# EAGLE design saha-aux (EAGLE 9.5.0)

## Sheet 1 of 3
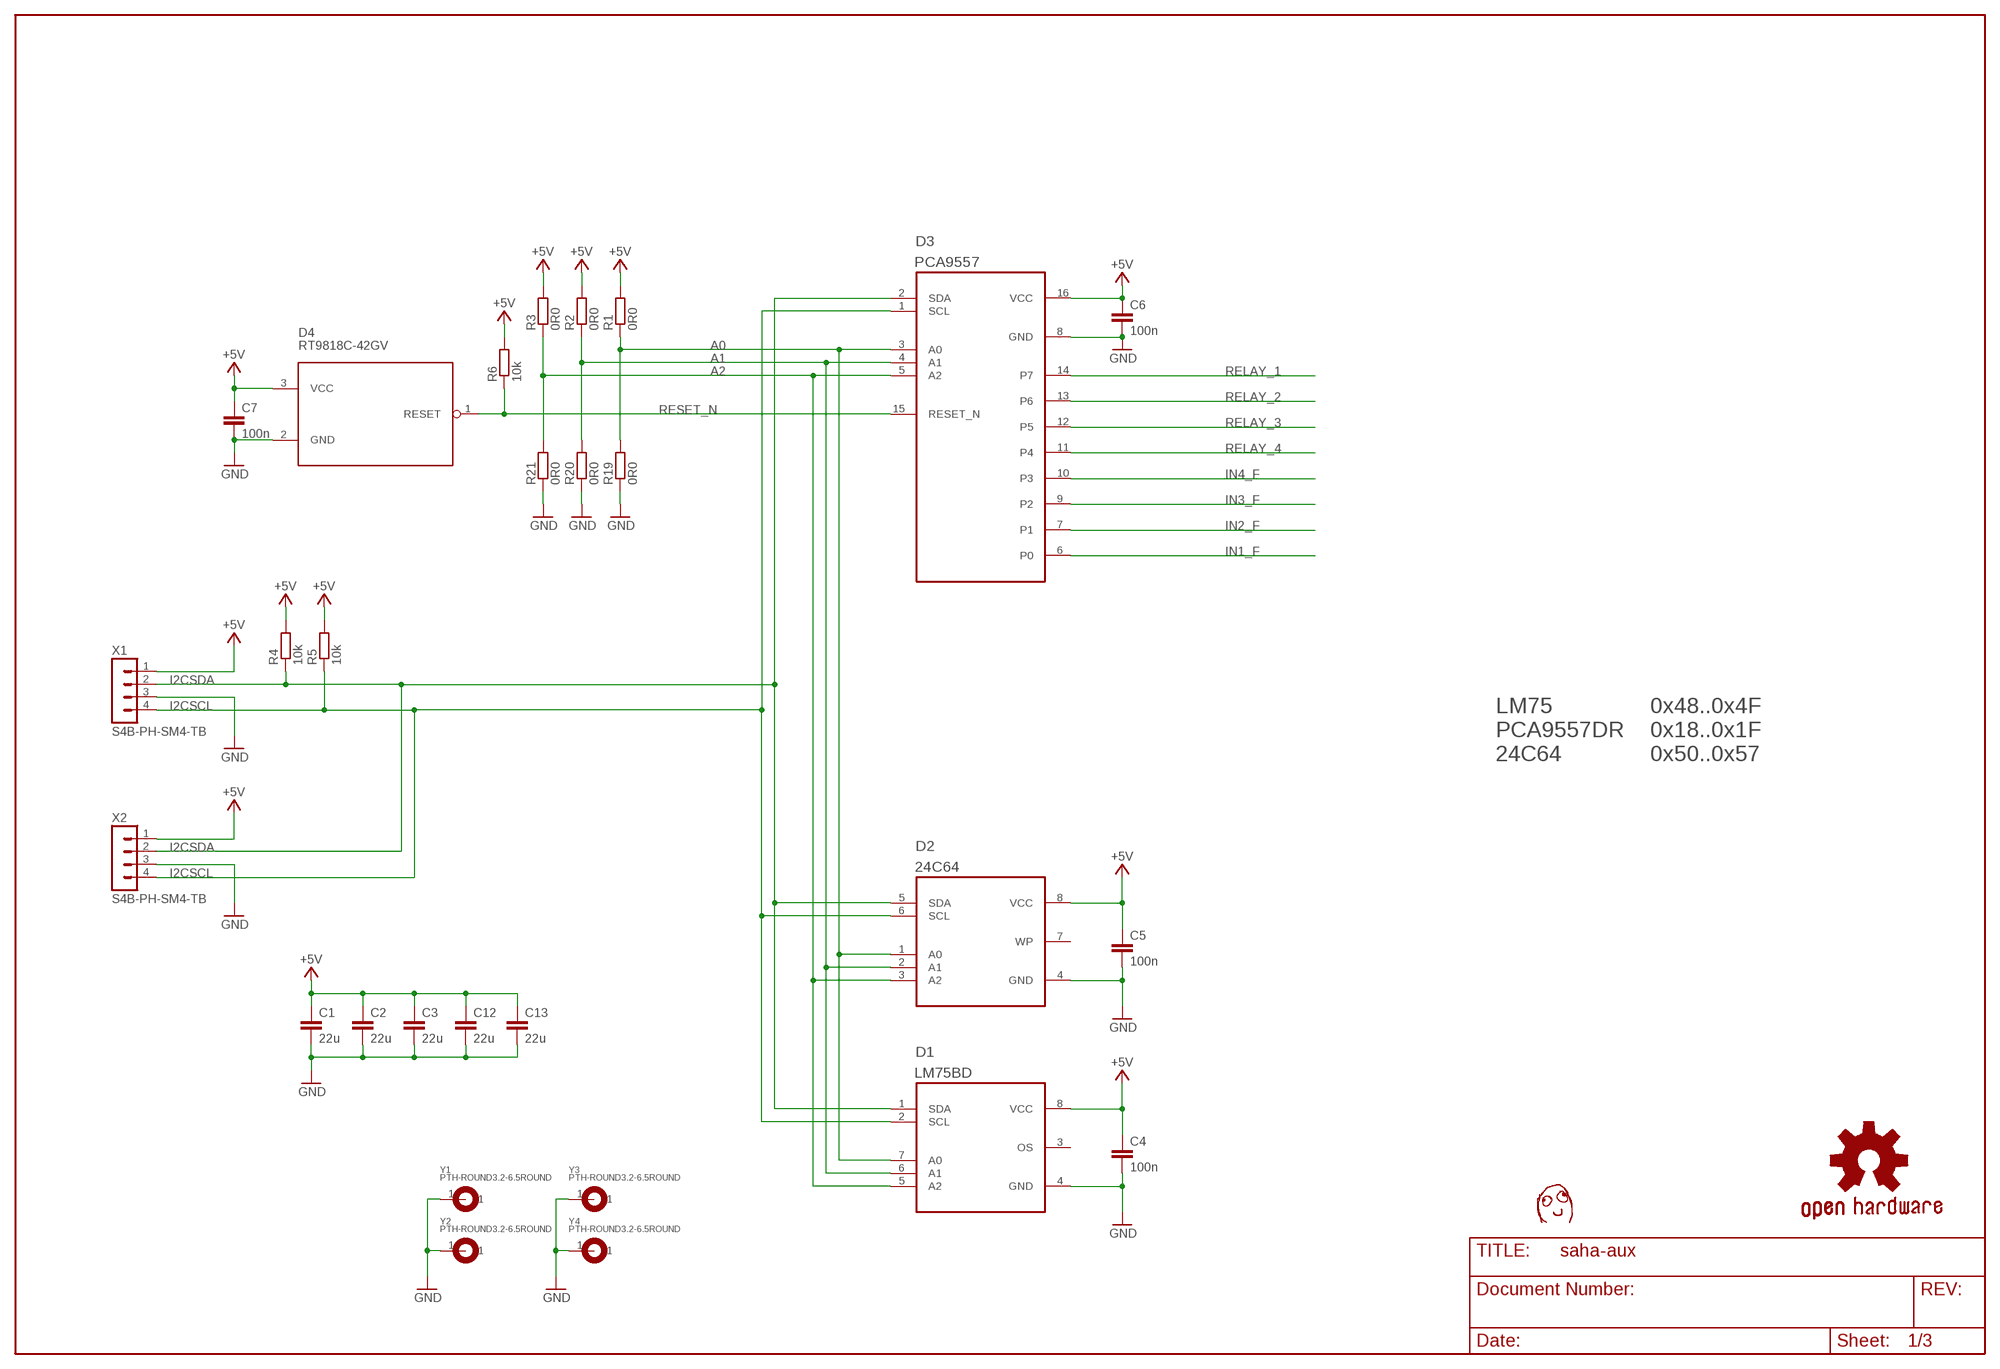
[diagram p0: schematic, sheet 1]

### Parts
C1  22u  CAP0805  [C0805]
C2  22u  CAP0805  [C0805]
C3  22u  CAP0805  [C0805]
C4  100n  CAP0603  [C0603]
C5  100n  CAP0603  [C0603]
C6  100n  CAP0603  [C0603]
C7  100n  CAP0603  [C0603]
C12  22u  CAP0805  [C0805]
C13  22u  CAP0805  [C0805]
D1  LM75BD  [SOIC8-N]
D2  24C64  [SOIC8-N]
D3  PCA9557  [SOIC16-N]
D4  RT9818C-42GV  [SOT23]
R1  0R0  RES0603  [R0603]
R2  0R0  RES0603  [R0603]
R3  0R0  RES0603  [R0603]
R4  10k  RES0603  [R0603]
R5  10k  RES0603  [R0603]
R6  10k  RES0603  [R0603]
R19  0R0  RES0603  [R0603]
R20  0R0  RES0603  [R0603]
R21  0R0  RES0603  [R0603]
U$1  DAFUG  [DAFUG]
X1  S4B-PH-SM4-TB  [JST-PH2.0-RA-4]
X2  S4B-PH-SM4-TB  [JST-PH2.0-RA-4]
Y1  PTH-ROUND3.2-6.5ROUND  [EKE_PTH-3.2-6.5]
Y2  PTH-ROUND3.2-6.5ROUND  [EKE_PTH-3.2-6.5]
Y3  PTH-ROUND3.2-6.5ROUND  [EKE_PTH-3.2-6.5]
Y4  PTH-ROUND3.2-6.5ROUND  [EKE_PTH-3.2-6.5]

### Nets
+5V: C1.1 C2.1 C3.1 C4.1 C5.1 C6.1 C7.1 C12.1 C13.1 D1.8(VCC) D2.8(VCC) D3.16(VCC) D4.3(VCC) R1.2 R2.2 R3.2 R4.2 R5.2 R6.2 X1.1 X2.1 ; also sheet 2,3
A0: D1.7(A0) D2.1(A0) D3.3(A0) R1.1 R19.2
A1: D1.6(A1) D2.2(A1) D3.4(A1) R2.1 R20.2
A2: D1.5(A2) D2.3(A2) D3.5(A2) R3.1 R21.2
GND: C1.2 C2.2 C3.2 C4.2 C5.2 C6.2 C7.2 C12.2 C13.2 D1.4(GND) D2.4(GND) D3.8(GND) D4.2(GND) R19.1 R20.1 R21.1 X1.3 X2.3 Y1.1 Y2.1 Y3.1 Y4.1 ; also sheet 2,3
I2CSCL: D1.2(SCL) D2.6(SCL) D3.1(SCL) R5.1 X1.4 X2.4
I2CSDA: D1.1(SDA) D2.5(SDA) D3.2(SDA) R4.1 X1.2 X2.2
IN1_F: D3.6(P0) ; also sheet 2
IN2_F: D3.7(P1) ; also sheet 2
IN3_F: D3.9(P2) ; also sheet 2
IN4_F: D3.10(P3) ; also sheet 2
RELAY_1: D3.14(P7) ; also sheet 3
RELAY_2: D3.13(P6) ; also sheet 3
RELAY_3: D3.12(P5) ; also sheet 3
RELAY_4: D3.11(P4) ; also sheet 3
RESET_N: D3.15(RESET_N) D4.1(RESET) R6.1
Unconnected: D1.3(OS) D2.7(WP)

### Notes on the sheet
- LM75     
  PCA9557DR
  24C64
- 0x48..0x4F
  0x18..0x1F
  0x50..0x57

## Sheet 2 of 3
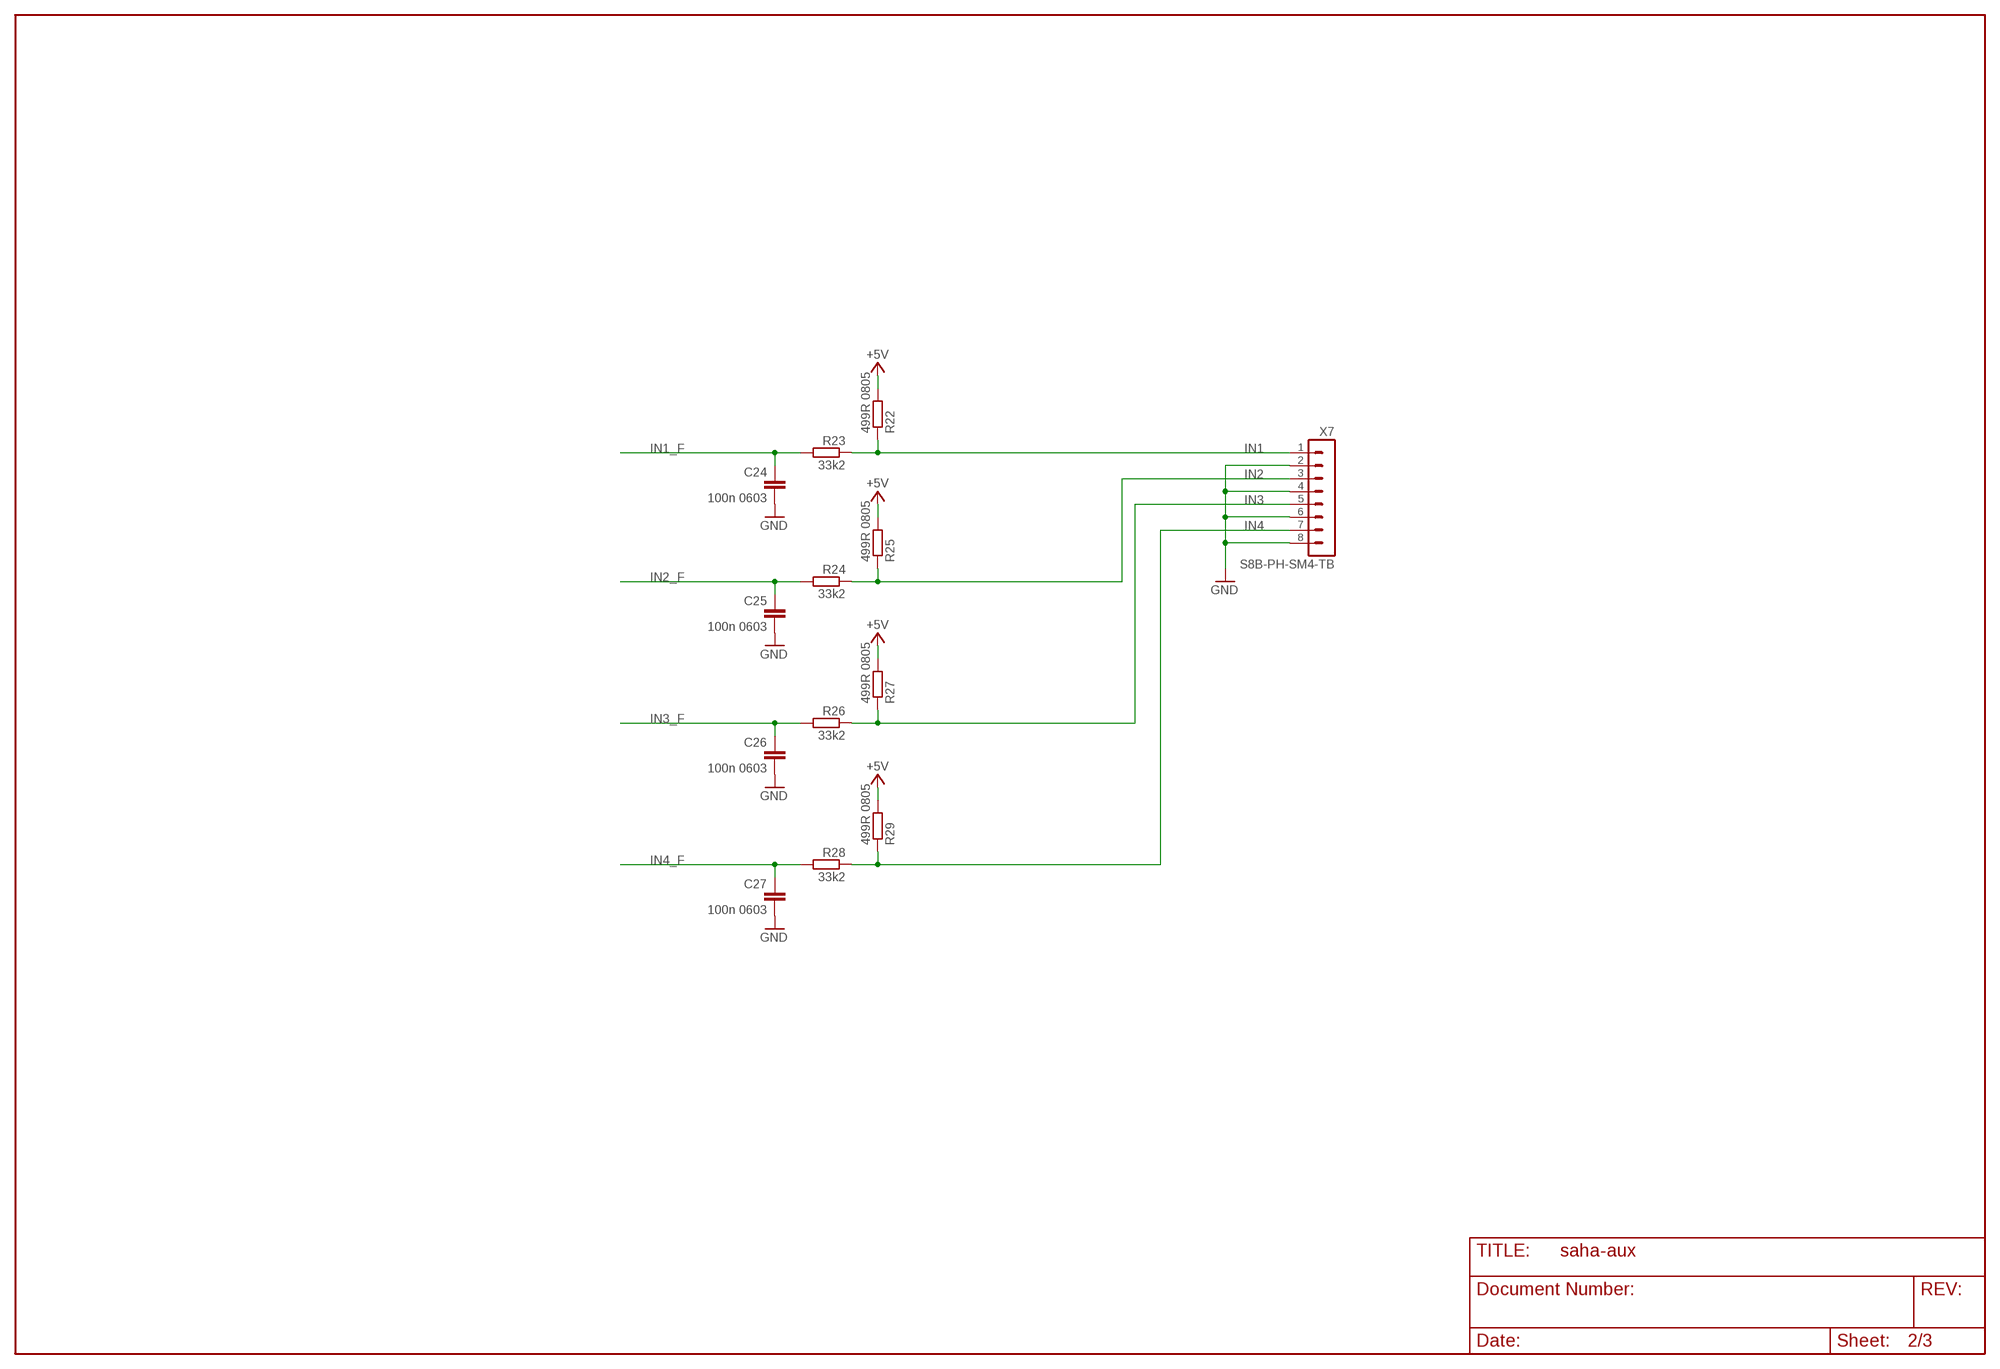
[diagram p1: schematic, sheet 2]

### Parts
C24  100n 0603  CAP0603  [C0603]
C25  100n 0603  CAP0603  [C0603]
C26  100n 0603  CAP0603  [C0603]
C27  100n 0603  CAP0603  [C0603]
R22  499R 0805  RES0805  [R0805]
R23  33k2  RES0603  [R0603]
R24  33k2  RES0603  [R0603]
R25  499R 0805  RES0805  [R0805]
R26  33k2  RES0603  [R0603]
R27  499R 0805  RES0805  [R0805]
R28  33k2  RES0603  [R0603]
R29  499R 0805  RES0805  [R0805]
X7  S8B-PH-SM4-TB  [JST-PH2.0-RA-8]

### Nets
+5V: R22.2 R25.2 R27.2 R29.2 ; also sheet 1,3
GND: C24.2 C25.2 C26.2 C27.2 X7.2 X7.4 X7.6 X7.8 ; also sheet 1,3
IN1: R22.1 R23.1 X7.1
IN1_F: C24.1 R23.2 ; also sheet 1
IN2: R24.1 R25.1 X7.3
IN2_F: C25.1 R24.2 ; also sheet 1
IN3: R26.1 R27.1 X7.5
IN3_F: C26.1 R26.2 ; also sheet 1
IN4: R28.1 R29.1 X7.7
IN4_F: C27.1 R28.2 ; also sheet 1

## Sheet 3 of 3
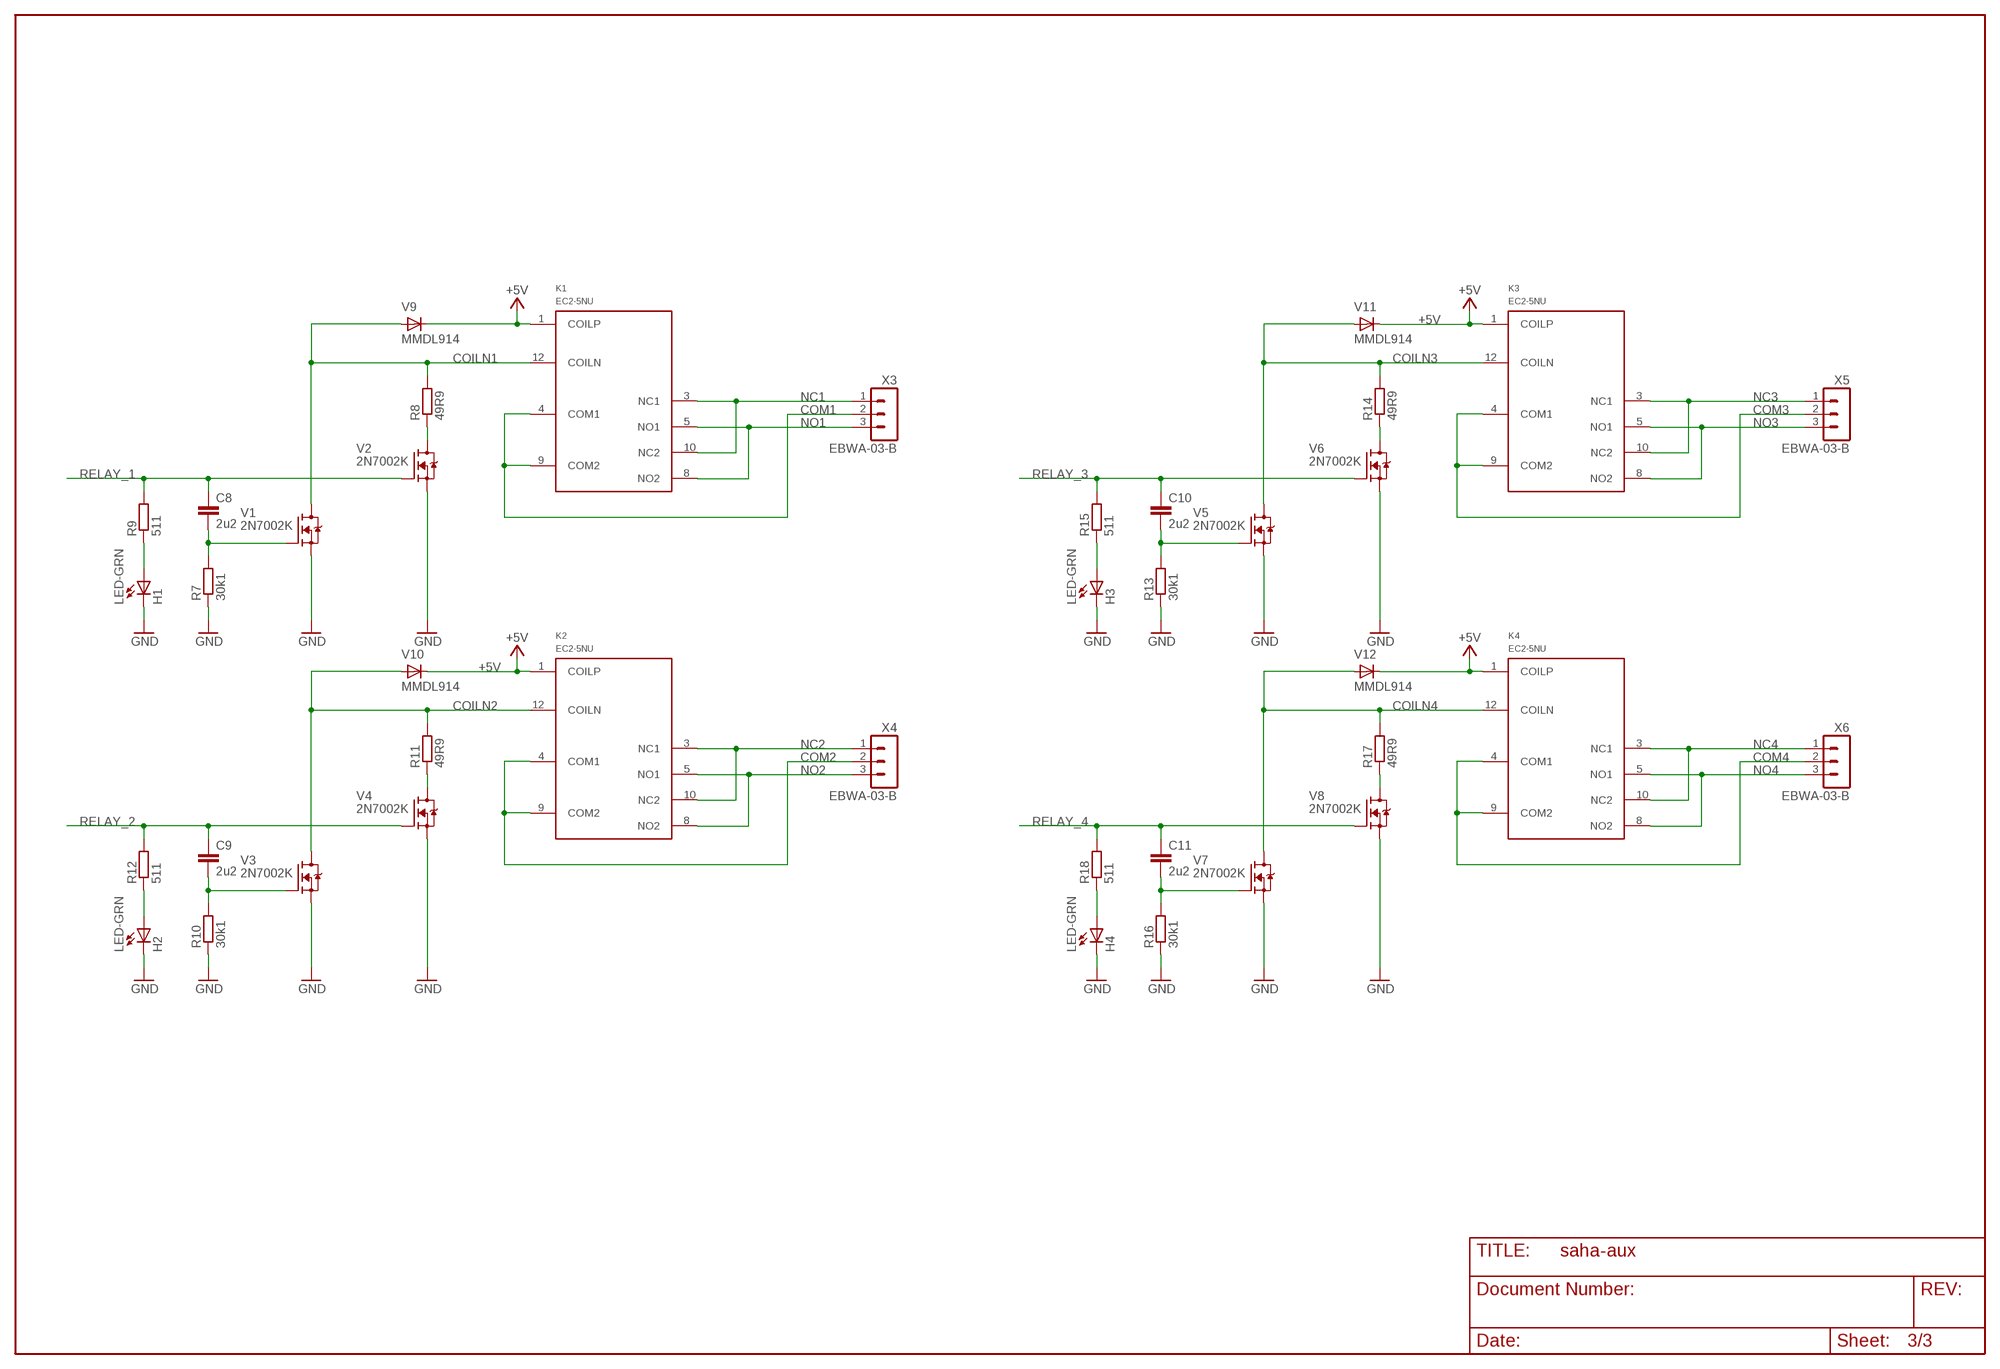
[diagram p2: schematic, sheet 3]

### Parts
C8  2u2  CAP0603  [C0603]
C9  2u2  CAP0603  [C0603]
C10  2u2  CAP0603  [C0603]
C11  2u2  CAP0603  [C0603]
H1  LED-GRN  [CHIP-LED0603]
H2  LED-GRN  [CHIP-LED0603]
H3  LED-GRN  [CHIP-LED0603]
H4  LED-GRN  [CHIP-LED0603]
K1  EC2-5NU  [EC2]
K2  EC2-5NU  [EC2]
K3  EC2-5NU  [EC2]
K4  EC2-5NU  [EC2]
R7  30k1  RES0603  [R0603]
R8  49R9  RES0805  [R0805]
R9  511  RES0603  [R0603]
R10  30k1  RES0603  [R0603]
R11  49R9  RES0805  [R0805]
R12  511  RES0603  [R0603]
R13  30k1  RES0603  [R0603]
R14  49R9  RES0805  [R0805]
R15  511  RES0603  [R0603]
R16  30k1  RES0603  [R0603]
R17  49R9  RES0805  [R0805]
R18  511  RES0603  [R0603]
V1  2N7002K  [SOT23]
V2  2N7002K  [SOT23]
V3  2N7002K  [SOT23]
V4  2N7002K  [SOT23]
V5  2N7002K  [SOT23]
V6  2N7002K  [SOT23]
V7  2N7002K  [SOT23]
V8  2N7002K  [SOT23]
V9  MMDL914  [SOD-323]
V10  MMDL914  [SOD-323]
V11  MMDL914  [SOD-323]
V12  MMDL914  [SOD-323]
X3  EBWA-03-B  [RUUVILIITIN381-3]
X4  EBWA-03-B  [RUUVILIITIN381-3]
X5  EBWA-03-B  [RUUVILIITIN381-3]
X6  EBWA-03-B  [RUUVILIITIN381-3]

### Nets
+5V: K1.1(COILP) K2.1(COILP) K3.1(COILP) K4.1(COILP) V9.C V10.C V11.C V12.C ; also sheet 1,2
COILN1: K1.12(COILN) R8.2 V1.3(D) V9.A
COILN2: K2.12(COILN) R11.2 V3.3(D) V10.A
COILN3: K3.12(COILN) R14.2 V5.3(D) V11.A
COILN4: K4.12(COILN) R17.2 V7.3(D) V12.A
COM1 [Rele]: K1.4(COM1) K1.9(COM2) X3.2
COM2 [Rele]: K2.4(COM1) K2.9(COM2) X4.2
COM3 [Rele]: K3.4(COM1) K3.9(COM2) X5.2
COM4 [Rele]: K4.4(COM1) K4.9(COM2) X6.2
GND: H1.C H2.C H3.C H4.C R7.1 R10.1 R13.1 R16.1 V1.2(S) V2.2(S) V3.2(S) V4.2(S) V5.2(S) V6.2(S) V7.2(S) V8.2(S) ; also sheet 1,2
N$6: H1.A R9.1
N$9: C8.2 R7.2 V1.1(G)
N$11: R8.1 V2.3(D)
N$15: C9.2 R10.2 V3.1(G)
N$17: R11.1 V4.3(D)
N$18: H2.A R12.1
N$22: C10.2 R13.2 V5.1(G)
N$24: R14.1 V6.3(D)
N$25: H3.A R15.1
N$29: C11.2 R16.2 V7.1(G)
N$31: R17.1 V8.3(D)
N$32: H4.A R18.1
NC1 [Rele]: K1.3(NC1) K1.10(NC2) X3.1
NC2 [Rele]: K2.3(NC1) K2.10(NC2) X4.1
NC3 [Rele]: K3.3(NC1) K3.10(NC2) X5.1
NC4 [Rele]: K4.3(NC1) K4.10(NC2) X6.1
NO1 [Rele]: K1.5(NO1) K1.8(NO2) X3.3
NO2 [Rele]: K2.5(NO1) K2.8(NO2) X4.3
NO3 [Rele]: K3.5(NO1) K3.8(NO2) X5.3
NO4 [Rele]: K4.5(NO1) K4.8(NO2) X6.3
RELAY_1: C8.1 R9.2 V2.1(G) ; also sheet 1
RELAY_2: C9.1 R12.2 V4.1(G) ; also sheet 1
RELAY_3: C10.1 R15.2 V6.1(G) ; also sheet 1
RELAY_4: C11.1 R18.2 V8.1(G) ; also sheet 1

## Library data of the parts
C1-C13 = saha-aux:CAP
C24-C27 = saha-cpu:CAP
D1 = saha-aux:LM75BD
D2 = saha-aux:24C64
D3 = saha-aux:PCA9557
D4 = saha-aux:RT9818C-42GV
H1-H4 = saha-aux:LED
K1-K4 = saha-aux:EC2-5NU
R1-R21 = saha-aux:RES
R22-R29 = saha-cpu:RES
U$1 = saha-aux:DAFUG
V1-V8 = saha-aux:2N7002K
V9-V12 = saha-aux:MMDL914
X1 X2 = saha-aux:S4B-PH-SM4-TB
X3-X6 = saha-aux:EBWA-03-B
X7 = saha-cpu:S8B-PH-SM4-TB
Y1-Y4 = saha-aux:PTH-ROUND

## Net classes
0 default: width 0.15 mm, drill 0.3 mm
1 CC: width 0.25 mm, drill 0.3 mm
2 Rele: width 1 mm, clearance 1 mm

## Board
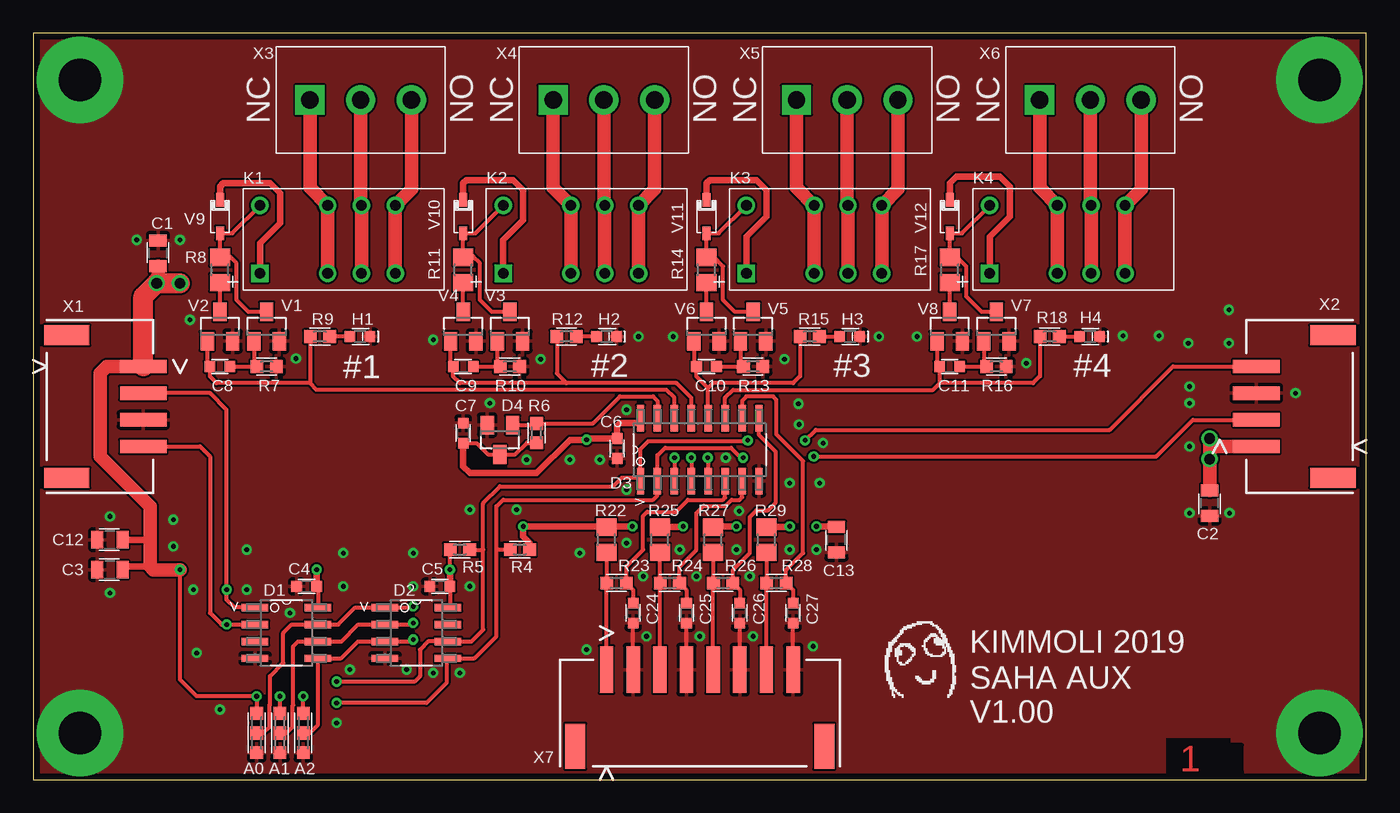
[diagram p3: board, top side]
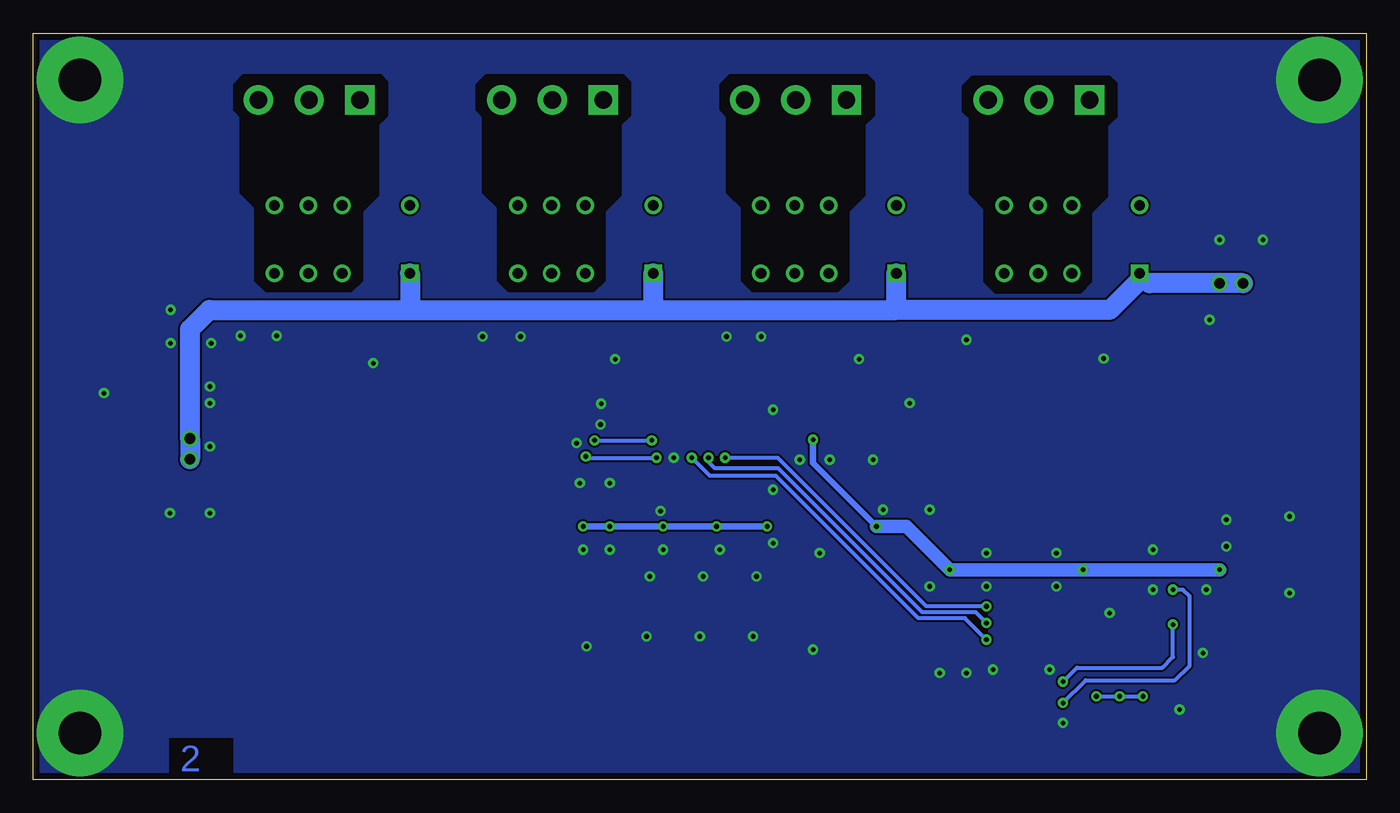
[diagram p4: board, bottom side, seen from below]

Size 100 x 56 mm. Coordinates in mm from the lower left corner, seen from the top.
Outline: 0,0 100,0 100,56 0,56 0,0
Copper layers (1*16): Top 0.035mm / dielectric 1.5mm / Bottom 0.035mm
Design rules "default *": minimum track width 6mil, minimum drill 0.35mm, track to track 6mil, track to pad 6mil, pad to pad 6mil, via to via 6mil, smd to smd 6mil, copper to edge 19mil, drill to drill 6mil, minimum pad ring 10mil, minimum via ring 8mil, stop-mask expansion 4mil, vias tented up to drill 0mil, thermal gap 10mil
tRestrict: area 85,0.4 to 89.8,3.1
bRestrict: area 85,0.4 to 89.8,3.1; area 18.9,36.7 to 30.1,52.6; area 37.1,36.8 to 48.3,52.7; area 55.4,36.8 to 66.6,52.7; area 73.6,36.8 to 84.8,52.7

### Footprints (pad centres in the part's own frame; a part is rotated, then mirrored left to right if it is on the bottom)
C0805 = smd 0.9 x 1.3: 1 -0.95,0; 2 0.95,0
C0603 = smd 0.8 x 0.8: 1 -0.75,0; 2 0.75,0
SOIC8-N = smd 1.981 x 0.559: 1 -2.362,1.905; 2 -2.362,0.635; 3 -2.362,-0.635; 4 -2.362,-1.905; 5 2.362,-1.905; 6 2.362,-0.635; 7 2.362,0.635; 8 2.362,1.905
SOIC16-N = smd 1.981 x 0.559: 1 -2.362,4.445; 2 -2.362,3.175; 3 -2.362,1.905; 4 -2.362,0.635; 5 -2.362,-0.635; 6 -2.362,-1.905; 7 -2.362,-3.175; 8 -2.362,-4.445; 9 2.362,-4.445; 10 2.362,-3.175; 11 2.362,-1.905; 12 2.362,-0.635; 13 2.362,0.635; 14 2.362,1.905; 15 2.362,3.175; 16 2.362,4.445
SOT23 = smd 1 x 1.4: 1 -0.95,-1.1; 2 0.95,-1.1; 3 0,1.1
CHIP-LED0603 = smd 0.8 x 0.8: A -0.75,0; C 0.75,0
EC2 = drill 0.8 square: 1 0,0 | drill 0.8: 3 5.08,0; 4 7.62,0; 5 10.16,0; 8 10.16,5.08; 9 7.62,5.08; 10 5.08,5.08; 12 0,5.08
R0603 = smd 0.95 x 0.95: 1 -0.725,0; 2 0.725,0
R0805 = smd 1.3 x 1.5: 1 -0.95,0; 2 0.95,0
SOD-323 = smd 1 x 0.6: A 1.25,0; C -1.25,0
JST-PH2.0-RA-4 = smd 1 x 3.5: 1 3,-7.25; 2 1,-7.25; 3 -1,-7.25; 4 -3,-7.25 | smd 1.5 x 3.4: M1 5.35,-1.5; M2 -5.35,-1.5
RUUVILIITIN381-3 = drill 1.3 pad 2.2 square: 1 0,0 | drill 1.3 pad 2.2: 2 3.81,0; 3 7.62,0
JST-PH2.0-RA-8 = smd 1 x 3.5: 1 7,-7.25; 2 5,-7.25; 3 3,-7.25; 4 1,-7.25; 5 -1,-7.25; 6 -3,-7.25; 7 -5,-7.25; 8 -7,-7.25 | smd 1.5 x 3.4: M1 9.35,-1.5; M2 -9.35,-1.5
EKE_PTH-3.2-6.5 = drill 3.2 pad 6.5: 1 0,0

### Placement (x,y rotation side)
C1  9.35,39.5 90 top
C2  88.25,20.75 270 top
C3  5.75,15.75 180 top
C4  20.5,14.5 180 top
C5  30.5,14.5 180 top
C6  43.8,24.85 270 top
C7  32.25,26 90 top
C8  14,31 0 top
C9  32.25,31 0 top
C10  50.5,31 0 top
C11  68.75,31 0 top
C12  5.75,18 180 top
C13  60.25,18 270 top
C24  45,12.5 270 top
C25  49,12.5 270 top
C26  53,12.5 270 top
C27  57,12.5 270 top
D1  19,11 0 top
D2  28.75,11 0 top
D3  50,24.75 90 top
D4  35,25.5 180 top
H1  24.5,33.25 0 top
H2  43,33.25 0 top
H3  61.25,33.25 0 top
H4  79.25,33.25 0 top
K1  17,38 0 top
K2  35.25,38 0 top
K3  53.5,38 0 top
K4  71.75,38 0 top
R1  16.75,4.25 90 top
R2  18.5,4.25 90 top
R3  20.25,4.25 90 top
R4  36.5,17.25 0 top
R5  32,17.25 180 top
R6  37.75,26 270 top
R7  17.5,31 180 top
R8  14,38.25 90 top
R9  21.5,33.25 180 top
R10  35.75,31 180 top
R11  32.25,38.25 90 top
R12  40,33.25 180 top
R13  54,31 180 top
R14  50.5,38.25 90 top
R15  58.25,33.25 180 top
R16  72.25,31 180 top
R17  68.75,38.25 90 top
R18  76.25,33.25 180 top
R19  16.75,2.75 90 top
R20  18.5,2.75 90 top
R21  20.25,2.75 90 top
R22  43,18 90 top
R23  43.75,14.75 0 top
R24  47.75,14.75 0 top
R25  47,18 90 top
R26  51.75,14.75 0 top
R27  51,18 90 top
R28  55.75,14.75 0 top
R29  55,18 90 top
U$1  66.75,8.75 0 top
V1  17.5,34 0 top
V2  14,34 0 top
V3  35.75,34 0 top
V4  32.25,34 0 top
V5  54,34 0 top
V6  50.5,34 0 top
V7  72.25,34 0 top
V8  68.75,34 0 top
V9  14,42.25 270 top
V10  32.25,42.25 270 top
V11  50.5,42.25 270 top
V12  68.75,42.25 270 top
X1  1,28 90 top
X2  99,28 270 top
X3  20.75,51 0 top
X4  39,51 0 top
X5  57.25,51 0 top
X6  75.5,51 0 top
X7  50,1 180 top
Y1  3.5,52.5 0 top
Y2  96.5,52.5 0 top
Y3  3.5,3.5 0 top
Y4  96.5,3.5 0 top

### Tracks (layer width: path | path; a pad name or v marks a point on that pad's centre or on a via)
+5V  (via drill 0.35, 0.8)
  Top 0.152: v44.95,19 43,19
  Top 0.3: R1.2 v16.75,6.25 12.25,6.25 11,7.5 v11,15.75 | R2.2 v18.5,6.25 | R3.2 v20.25,6.25 | C4.1 21.36,14.39 D1.8 | C5.1 31.25,13.04 D2.8 | v31.25,15.75 31.25,17.23 R5.2 | 37.23,18.98 37.25,19 | C7.1 33.25,25.25 34.1,24.4 D4.3 36.15,24.4 37.02,25.27 R6.2
  Top 0.5: v21.25,15.75 C4.1 | v31.25,15.75 C5.1 | 43,19 37.25,19 v36.75,19 36.75,18.25 37.23,17.77 R4.2 | v56.75,19 56.7,18.95 R29.2 | R27.2 51.05,19 v52.75,19 | R25.2 48.7,18.95 v48.75,19 | D3.16 45.55,26.86 45.44,26.75 44,26.75 43.8,26.55 C6.1 41.5,25.6 v41.5,25.5 40.25,25.5 37.75,23 32.75,23 32.25,23.5 C7.1 | C12.1 8.75,18 | C3.1 6.95,16 8.75,16 | V9.C 14,44.5 14.25,44.75 17.75,44.75 18.5,44 18.5,41.75 17,40.25 K1.1 | V10.C 32.25,44.75 32.5,45 36,45 36.75,44.25 36.75,42 35.25,40.5 K2.1 | V11.C 50.5,44.75 50.75,45 54.25,45 55,44.25 55,42.25 53.5,40.75 K3.1 | V12.C 68.75,44.75 69.25,45.25 72.5,45.25 73.25,44.5 73.25,42.25 71.75,40.75 K4.1 | 43.05,19 v44.95,19 | v58.75,19 60.2,19 C13.1
  Top 1: X2.1 88.85,25 v88.25,25.6 C2.1 | C1.1 9.35,37.35 | X1.1 5.5,31 5,30.5 5,24.25 8.75,20.5 8.75,18 8.75,16 9,15.75 v11,15.75 | R22.2 43.05,19
  Top 1.5: X1.1 8.25,36.25 v9.25,37.25 | 9.35,37.35 v9.25,37.25 | v9.25,37.25 v11,37.25
  Bottom 0.3: v16.75,6.25 v18.5,6.25 v20.25,6.25
  Bottom 0.5: v44.95,19 v48.75,19 v52.75,19 v56.75,19 v58.75,19 | v36.75,19 41.5,23.75 v41.5,25.5
  Bottom 1: 16.25,37.25 K1.1 17,37.5 | 71.75,35.75 71.25,35.25 | v11,15.75 v21.25,15.75 v31.25,15.75 34.5,19 v36.75,19
  Bottom 1.5: v9.25,37.25 16.25,37.25 | 17,37.5 19.25,35.25 35.25,35.25 | 35.25,35.25 K2.1 | K3.1 53.5,35.5 53.25,35.25 | 53.25,35.25 35.25,35.25 | K4.1 71.75,35.75 | 53.25,35.25 71.25,35.25 86.8,35.25 88.25,33.8 v88.25,25.6 v88.25,24.05
A0  (via drill 0.35)
  Top 0.3: R1.1 R19.2 16.77,3.5 17.25,3.5 17.72,3.97 17.72,5.58 17.75,5.6 17.75,7.75 18.75,8.75 18.75,11 19.39,11.63 D1.7 22.89,11.63 24.16,12.9 D2.1 28.41,12.9 v28.5,13 | v48.1,24.15 v48.09,24.14 D3.3
  Bottom 0.3: v28.5,13 33,13 44.15,24.15 v48.1,24.15
A1  (via drill 0.35)
  Top 0.152: R2.1 R20.2
  Top 0.3: R20.2 18.52,3.5 19,3.5 19.47,3.97 19.47,5.58 19.5,5.6 19.5,10 19.86,10.37 D1.6 23.11,10.37 24.39,11.63 D2.2 28.39,11.63 v28.5,11.75 | v49.35,24.15 49.37,24.14 D3.4
  Bottom 0.3: v28.5,11.75 29.3,12.55 33.3,12.55 44.1,23.35 48.85,23.35 49.35,23.85 v49.35,24.15
A2  (via drill 0.35)
  Top 0.152: R3.1 R21.2
  Top 0.3: R21.2 20.27,3.5 20.75,3.5 21.36,4.11 D1.5 23.09,9.1 24.36,10.37 D2.3 28.36,10.37 v28.5,10.5 | v50.6,24.15 50.63,24.11 D3.5
  Bottom 0.3: v28.5,10.5 30.09,12.1 33.59,12.1 44.3,22.8 49.24,22.8 v50.59,24.15 v50.6,24.15
COILN1
  Top 0.3: K1.12 14.92,41 V9.A R8.2 14.8,39.2 15.25,38.75 15.25,36 16.15,35.1 V1.3
COILN2
  Top 0.3: R11.2 32.25,39.25 | 32.25,39.25 V10.A 33.17,41 K2.12 | V3.3 34.4,35.1 33.5,36 33.5,38.75 33,39.25 32.25,39.25
COILN3
  Top 0.3: K3.12 51.42,41 V11.A R14.2 51.05,39.2 51.75,38.5 51.75,36 52.65,35.1 V5.3
COILN4
  Top 0.3: R17.2 68.75,39.25 | 68.75,39.25 V12.A 69.67,41 K4.12 | V7.3 71.15,35.1 70,36.25 70,38.5 69.25,39.25 68.75,39.25
COM1
  Top 1: X3.2 24.56,43.14 K1.9 K1.4
COM2
  Top 1: X4.2 42.81,43.14 K2.9 K2.4
COM3
  Top 1: X5.2 61.06,43.14 K3.9 K3.4
COM4
  Top 1: X6.2 79.31,43.14 K4.9 K4.4
GND  (via drill 0.35)
  Top 0.3: X7.2 C24.2 | X7.8 C27.2 | X7.6 C26.2 | X7.4 C25.2
  other vias: 45.4,33.25 57.4,28.2 56.75,22.25 59,22.25 59.25,25.25 57.45,26.65 52.95,20.15 56.75,17.25 52.75,17.25 48.5,17.25 44.5,17.75 45.75,15.25 49.75,15.25 53.75,15.25 41,17 36.25,20.25 32.75,20.25 51.95,24.15 40.25,24 34.25,28.25 5.75,19.75 5.75,14 10.5,17.5 10.5,19.5 12,14.25 16,14.25 16,17.25 23.25,14.5 23.25,17 28.5,14.5 28.5,17 32.75,14.5 28,8.25 19.25,12.5 23.75,8.25 12.25,9.5 14,5.25 22.75,4.25 30,8 32,8 58.5,10 54,10.75 50,10.75 46,10.75 41.5,9.75 66.3,33.25 74.5,31.25 56.35,31.55 48,33.25 30,33 38.05,31.55 11.75,34.5 19.7,31.6 86.75,29.5 86.75,28.25 86.65,32.75 86.75,25 94.7,29 89.7,32.75 84.45,33.3 89.7,35.25 89.75,20 86.75,20 7.75,40.5 11,40.5 37,24 44.5,27.75 42.5,24 63.45,33.25 81.75,33.3 58.75,17.25 44.5,21.75
  pour Top: 0,0 100,0 100,56 0,56
  pour Bottom: 0,0 100,0 100,56 0,56
I2CSCL  (via drill 0.35)
  Top 0.3: X1.4 12.5,25 13.25,24.25 13.25,12.5 14.12,11.63 v14.5,11.63 D1.2 | v53.6,25.45 53.55,25.4 46.15,25.4 45.55,24.8 D3.1 45.55,22.64 44.14,22.64 43.5,22 35,22 33.75,20.75 33.75,17.25 | v57.9,25.45 58.7,26.25 80.75,26.25 85.5,31 X2.4 | v22.75,7.35 28.6,7.35 29,7.75 29,9.75 29.61,10.37 D2.6 32.87,10.37 33.75,11.25 33.75,17.25 | R5.1 33.75,17.25
  Bottom 0.3: v57.9,25.45 v53.6,25.45 | v22.75,7.35 21.7,8.4 15.3,8.4 14.5,9.2 v14.5,11.63
I2CSDA  (via drill 0.35)
  Top 0.3: D1.1 15.1,12.9 14.5,13.5 v14.5,14.25 14.5,27.75 13.25,29 X1.2 | v53.25,24.15 53.1,24.15 52.35,24.9 47.4,24.9 46.83,24.32 D3.2 46.83,21.32 46.5,21 35.25,21 34.75,20.5 34.75,17.25 | v58.55,24.25 84.25,24.25 87,27 X2.2 | v22.75,5.75 29.5,5.75 31,7.25 31,8.98 D2.5 33.09,9.1 34.75,10.75 34.75,17.25 | R4.1 34.75,17.25
  Bottom 0.3: v58.55,24.25 58.45,24.15 v53.25,24.15 | v22.75,5.75 21.05,7.45 14.35,7.45 13.25,8.55 13.25,13.75 13.75,14.25 v14.5,14.25
IN1
  Top 0.3: X7.1 43,14.72 R23.1 43.02,17.02 R22.1
IN1_F
  Top 0.3: C24.1 45,14.22 R23.2 44.5,14.78 44.5,16 45.75,17.25 45.75,19.8 46.05,20.1 48.21,20.1 49.11,21 51.75,21 51.91,21.16 D3.6
IN2
  Top 0.3: X7.3 47,14.72 R24.1 47.02,17.02 R25.1
IN2_F
  Top 0.3: C25.1 49,14.22 R24.2 48.48,15.97 49.75,17.25 49.75,20 50.3,20.55 51.94,20.55 52.39,21 53,21 53.17,21.18 D3.7
IN3
  Top 0.3: X7.5 51,14.72 R26.1 51.02,17.02 R27.1
IN3_F
  Top 0.3: C26.1 53,14.22 R26.2 52.48,15.72 53.75,17 53.75,19.7 54.25,20.2 55.1,20.2 55.7,20.8 55.7,24.6 54.45,25.86 D3.9
IN4
  Top 0.3: X7.7 55,14.72 R28.1 55.02,17.02 R29.1
IN4_F
  Top 0.3: C27.1 57,14.22 R28.2 56.48,15.72 57.75,17 57.75,23.9 55.75,25.9 55.75,28.5 55.5,28.75 53.5,28.75 53.17,28.43 D3.10
N$6
  Top 0.3: H1.A R9.1
N$9
  Top 0.3: C8.2 16.5,31 | 16.5,31 R7.2 | V1.1 16.55,31.05 16.5,31
N$11
  Top 0.3: V2.3 R8.1
N$15
  Top 0.3: C9.2 34.75,31 | 34.75,31 R10.2 | V3.1 34.8,31.05 34.75,31
N$17
  Top 0.3: V4.3 R11.1
N$18
  Top 0.3: H2.A R12.1
N$22
  Top 0.3: V5.1 53.05,31.23 R13.2 C10.2
N$24
  Top 0.3: V6.3 R14.1
N$25
  Top 0.3: R15.1 H3.A
N$29
  Top 0.3: C11.2 71.25,31 | 71.25,31 R16.2 | V7.1 71.3,31.05 71.25,31
N$31
  Top 0.3: V8.3 R17.1
N$32
  Top 0.3: R18.1 H4.A
NC1
  Top 1: X3.1 20.75,44.41 K1.10 K1.3
NC2
  Top 1: X4.1 39,44.41 K2.10 K2.3
NC3
  Top 1: X5.1 57.25,44.41 K3.10 K3.3
NC4
  Top 1: X6.1 75.5,44.41 K4.10 K4.3
NO1
  Top 1: X3.3 28.37,44.29 K1.8 K1.5
NO2
  Top 1: X4.3 46.62,44.29 K2.8 K2.5
NO3
  Top 1: X5.3 64.87,44.29 K3.8 K3.5
NO4
  Top 1: X6.3 83.12,44.29 K4.8 K4.5
RELAY_1
  Top 0.3: V2.1 13.05,31.2 C8.1 13.25,30.25 13.75,29.75 20.75,29.75 | D3.14 48.09,28.66 47.5,29.25 21.25,29.25 20.75,29.75 | 20.75,29.75 20.77,29.77 R9.2
RELAY_2
  Top 0.3: V4.1 31.3,31.2 C9.1 31.5,30.25 32,29.75 40,29.75 | 39.25,33.23 R12.2 39.27,30.48 40,29.75 | D3.13 49.37,28.64 48.25,29.75 40,29.75
RELAY_3
  Top 0.3: R15.2 57.52,30.27 57,29.75 51,29.75 50.63,29.39 50.63,29.36 | 50.63,29.36 49.75,30.25 C10.1 49.55,31.2 V6.1 | D3.12 50.63,29.36
RELAY_4
  Top 0.3: R18.2 75.53,30.27 75,29.75 68,29.75 | 68,29.75 C11.1 67.8,31.2 V8.1 | D3.11 51.91,28.66 52.5,29.25 67.5,29.25 68,29.75
RESET_N
  Top 0.3: D4.1 37.62,26.6 R6.1 41.98,26.73 44,28.75 46.5,28.75 46.83,28.43 D3.15

### Text on the board
Top: 1
Bottom: 2
tPlace: NC | NO | NC | NO | NC | NO | NC | NO | #1 | #2 | #3 | #4 | KIMMOLI 2019 | SAHA AUX / V1.00 | A0 A1 A2